# EAGLE design arduinoDcc1.2 (EAGLE 6.6.0)
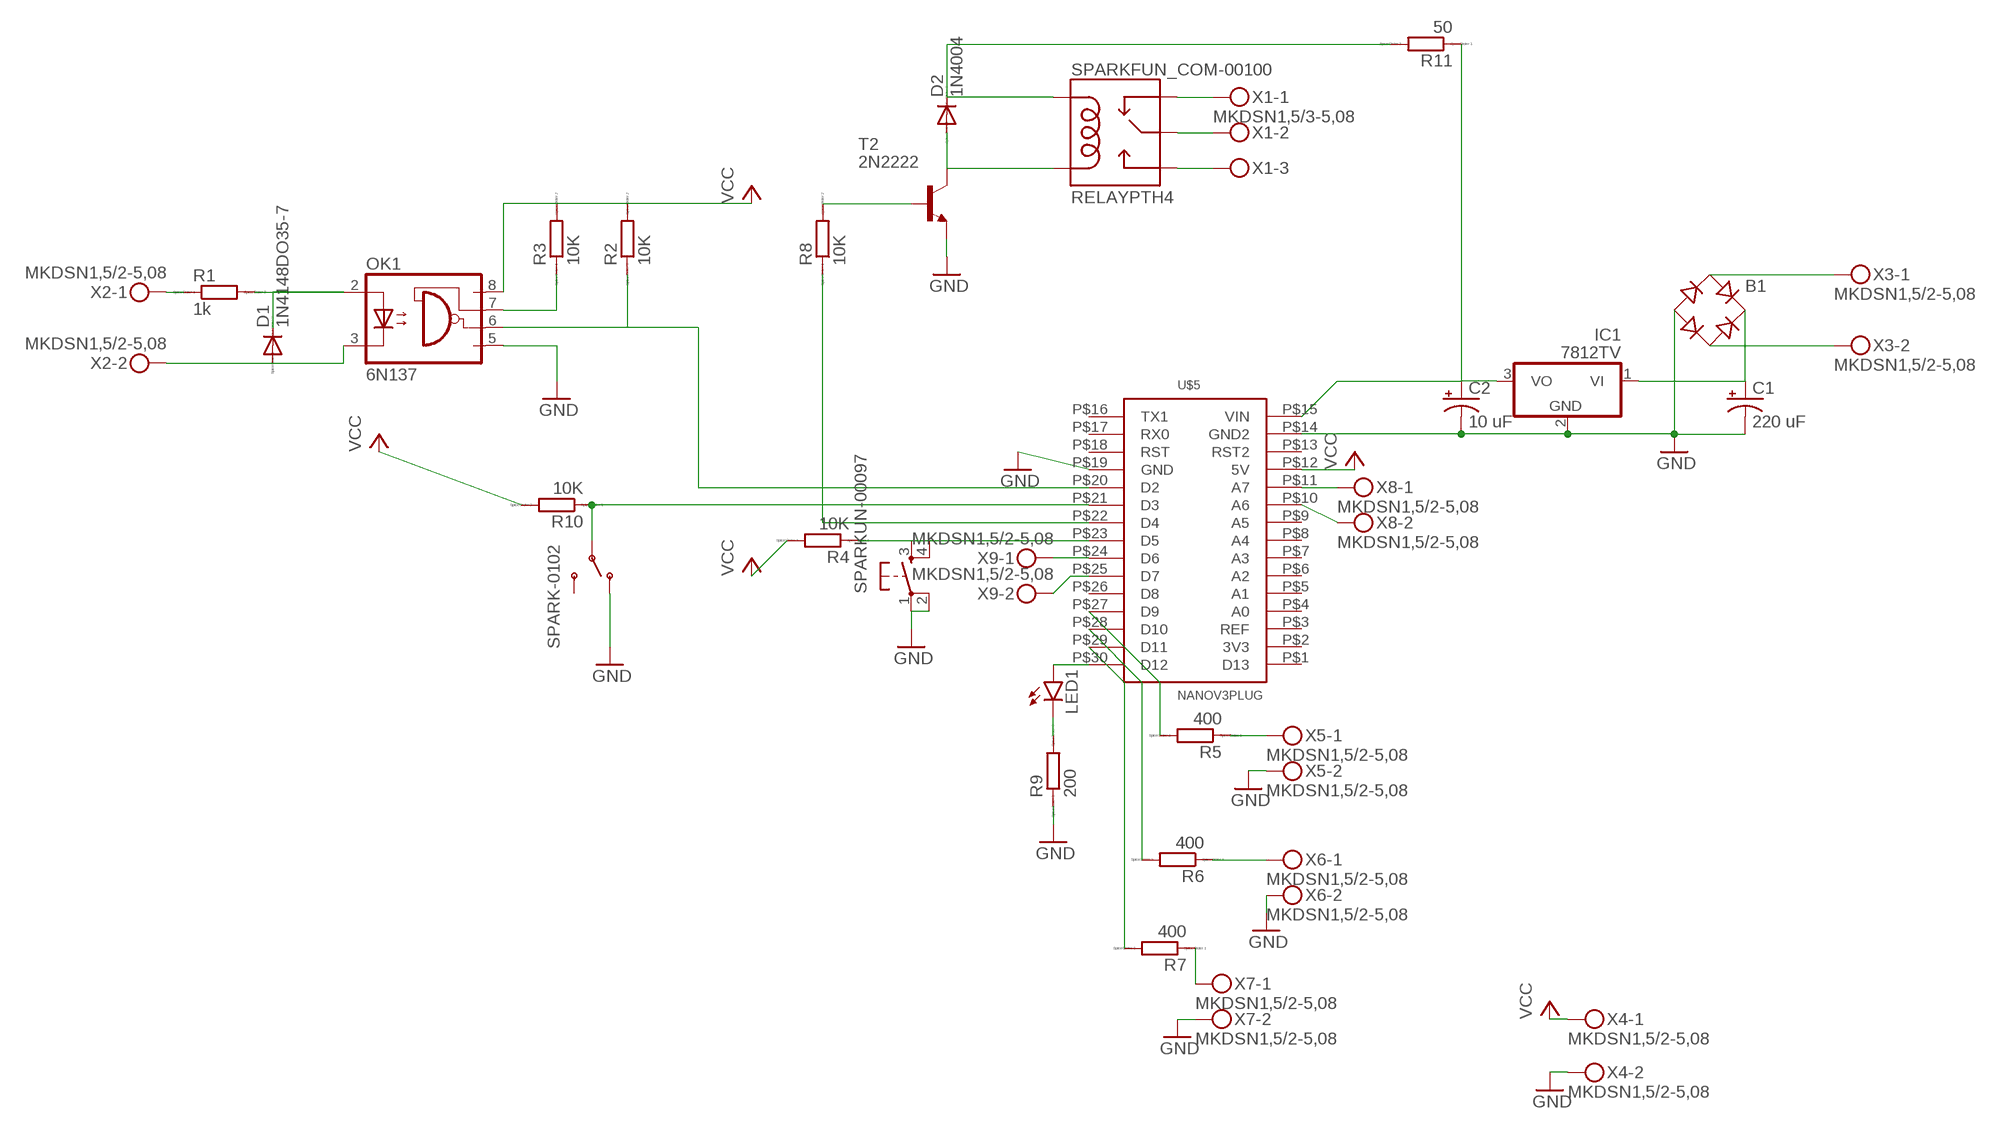
[diagram p0: schematic, sheet 1]

## Parts
B1  RB1A  [RB1A]
C1  220 uF  CAP_POLPTH1  [CPOL-RADIAL-100UF-25V]
C2  10 uF  CAP_POLPTH1  [CPOL-RADIAL-100UF-25V]
D1  1N4148DO35-7  [DO35-7]
D2  1N4004  [DO41-10]
IC1  7812TV  [TO220V]
LED1  LED3MM  [LED3MM]
OK1  6N137  [DIL08]
R1  1k  R0207/10  [0207/10]
R2  10K  R0207/10  [0207/10]
R3  10K  R0207/10  [0207/10]
R4  10K  R0207/10  [0207/10]
R5  400  R0207/10  [0207/10]
R6  400  R0207/10  [0207/10]
R7  400  R0207/10  [0207/10]
R8  10K  R0207/10  [0207/10]
R9  200  R0204/7  [0204/7]
R10  10K  R0207/10  [0207/10]
R11  50  R0207/10  [0207/10]
SPARK-0102  SWITCH-SPDTPTH  [SWITCH-SPDT]
SPARKFUN_COM-00100  RELAYPTH4  [RELAY-JZC]
SPARKUN-00097  TAC_SWITCHPTH  [TACTILE-PTH]
T2  2N2222  [TO18]
U$5  NANOV3PLUG  [HEADER15-2]
X1  MKDSN1,5/3-5,08  [MKDSN1,5/3-5,08]
X2  MKDSN1,5/2-5,08  [MKDSN1,5/2-5,08]
X3  MKDSN1,5/2-5,08  [MKDSN1,5/2-5,08]
X4  MKDSN1,5/2-5,08  [MKDSN1,5/2-5,08]
X5  MKDSN1,5/2-5,08  [MKDSN1,5/2-5,08]
X6  MKDSN1,5/2-5,08  [MKDSN1,5/2-5,08]
X7  MKDSN1,5/2-5,08  [MKDSN1,5/2-5,08]
X8  MKDSN1,5/2-5,08  [MKDSN1,5/2-5,08]
X9  MKDSN1,5/2-5,08  [MKDSN1,5/2-5,08]

## Nets
GND: B1.- C1.2(-) C2.2(-) IC1.2(GND) OK1.5(GND) R9.1 SPARK-0102.1(O) SPARKUN-00097.1 SPARKUN-00097.2 T2.1(E) U$5.P$14(GND2) U$5.P$19(GND) X4.2 X5.2 X6.2 X7.2
N$1: R1.1 X2.1
N$2: D1.C OK1.2(A) R1.2
N$3: D1.A OK1.3(C) X2.2
N$4: R10.1 SPARK-0102.2(P) U$5.P$21(D3)
N$5: D2.A SPARKFUN_COM-00100.1(COIL2) T2.3(C)
N$6: OK1.6(VO) R2.1 U$5.P$20(D2)
N$7: OK1.7(VE) R3.1
N$8: B1.AC1 X3.1
N$9: SPARKFUN_COM-00100.2(NC) X1.1
N$10: SPARKFUN_COM-00100.4(MAIN) X1.2
N$11: SPARKFUN_COM-00100.3(NO) X1.3
N$12: R8.1 U$5.P$22(D4)
N$13: R6.1 X6.1
N$14: R7.2 U$5.P$29(D11)
N$15: R6.2 U$5.P$28(D10)
N$16: R5.2 U$5.P$27(D9)
N$17: R5.1 X5.1
N$18: R4.1 SPARKUN-00097.3 SPARKUN-00097.4 U$5.P$23(D5)
N$19: U$5.P$24(D6) X9.1
N$20: U$5.P$25(D7) X9.2
N$21: U$5.P$11(A7) X8.1
N$22: U$5.P$10(A6) X8.2
N$23: B1.AC2 X3.2
N$24: B1.+ C1.1(+) IC1.1(VI)
N$25: LED1.K(C) R9.2
N$26: LED1.A U$5.P$30(D12)
N$27: R7.1 X7.1
N$28: C2.1(+) IC1.3(VO) R11.1 U$5.P$15(VIN)
N$29: R8.2 T2.2(B)
N$30: D2.C R11.2 SPARKFUN_COM-00100.5(COIL1)
VCC: OK1.8(VCC) R2.2 R3.2 R4.2 R10.2 U$5.P$12(5V) X4.1
Unconnected: SPARK-0102.3(S) U$5.P$1(D13) U$5.P$2(3V3) U$5.P$3(REF) U$5.P$4(A0) U$5.P$5(A1) U$5.P$6(A2) U$5.P$7(A3) U$5.P$8(A4) U$5.P$9(A5) U$5.P$13(RST2) U$5.P$16(TX1) U$5.P$17(RX0) U$5.P$18(RST) U$5.P$26(D8)

## Library data of the parts
B1 = rectifier:RB1A: RECTIFIER 1 A
C1 C2 = SparkFun-Capacitors:CAP_POL: Capacitor Polarized These are standard SMD and PTH capacitors. Normally 10uF, 47uF, and 100uF in electrolytic and tantalum varieties. Always verify the external diameter of the through hole cap, it varies with capacity, voltage, and manufacturer. The EIA devices should be standard.
D1 = diode:1N4148: DIODE high speed (Philips)
D2 = diode:1N4004: DIODE general purpose rectifier, 1 A
IC1 = linear:78*: Positive VOLTAGE REGULATOR Source: http://cache.national.com/ds/LM/LM78L05.pdf http://www.fairchildsemi.com/ds/LM/LM7805.pdf
LED1 = SparkFun-LED:LED: LEDs Standard schematic elements and footprints for 5mm, 3mm, 1206, and 0603 sized LEDs. 5mm - Spark Fun Electronics SKU : COM-00529 (and others)
OK1 = optocoupler:6N137: MOTOROLA OPTO COUPLER; MPN: 6N137; OC_FARNELL: 1328376; OC_NEWARK: 52M1895
R1-R11 = eagle-ltspice:R: RESISTOR, European symbol; SPICEMODEL: NONE; SPICEPREFIX: R
SPARK-0102 = SparkFun-Electromechanical:SWITCH-SPDT: SPDT Switch Simple slide switch, Spark Fun Electronics SKU : COM-00102 DPDT SMT slide switch, AYZ0202, SWCH-08179
SPARKFUN_COM-00100 = SparkFun-Electromechanical:RELAY: SPDT relay (COM-00101)
SPARKUN-00097 = SparkFun-Electromechanical:TAC_SWITCH: Momentary Switch Button commonly used for reset or general input. Spark Fun Electronics SKU : COM-00097 SMT- SWCH-08247
T2 = transistor:2N2222: NPN TRANSISTOR
U$5 = ArduinoNanoPlug:NANOV3PLUG
X1 = con-phoenix-508:MKDSN1,5/3-5,08: MKDSN 1,5/ 3-5,08 Printklemme Nennstrom: 13,5 A Nennspannung: 250 V Rastermaß: 5,08 mm Polzahl: 3 Anschlussart: Schraubanschluss Montage: Löten Anschlussrichtung Leiter/Platine: 0 ° Artikelnummer: 1729131 Source: http://eshop.phoenixcontact.com .. 1729131.pdf
X2-X9 = con-phoenix-508:MKDSN1,5/2-5,08: MKDSN 1,5/ 2-5,08 Printklemme Nennstrom: 13,5 A Nennspannung: 250 V Rastermaß: 5,08 mm Polzahl: 2 Anschlussart: Schraubanschluss Montage: Löten Anschlussrichtung Leiter/Platine: 0 ° Artikelnummer: 1729128 Source: http://eshop.phoenixcontact.com .. 1729128.pdf

## Board
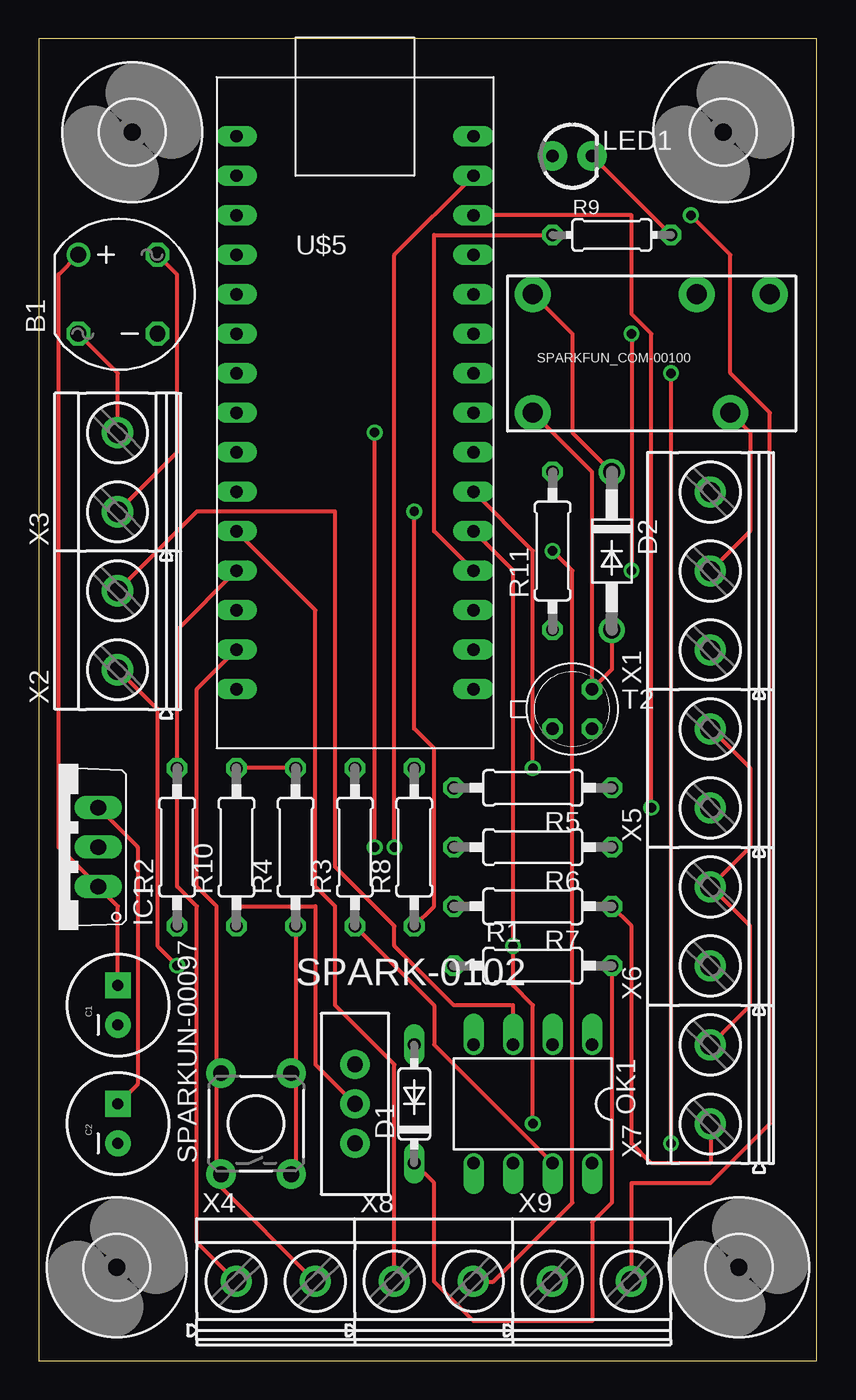
[diagram p1: board, top side]
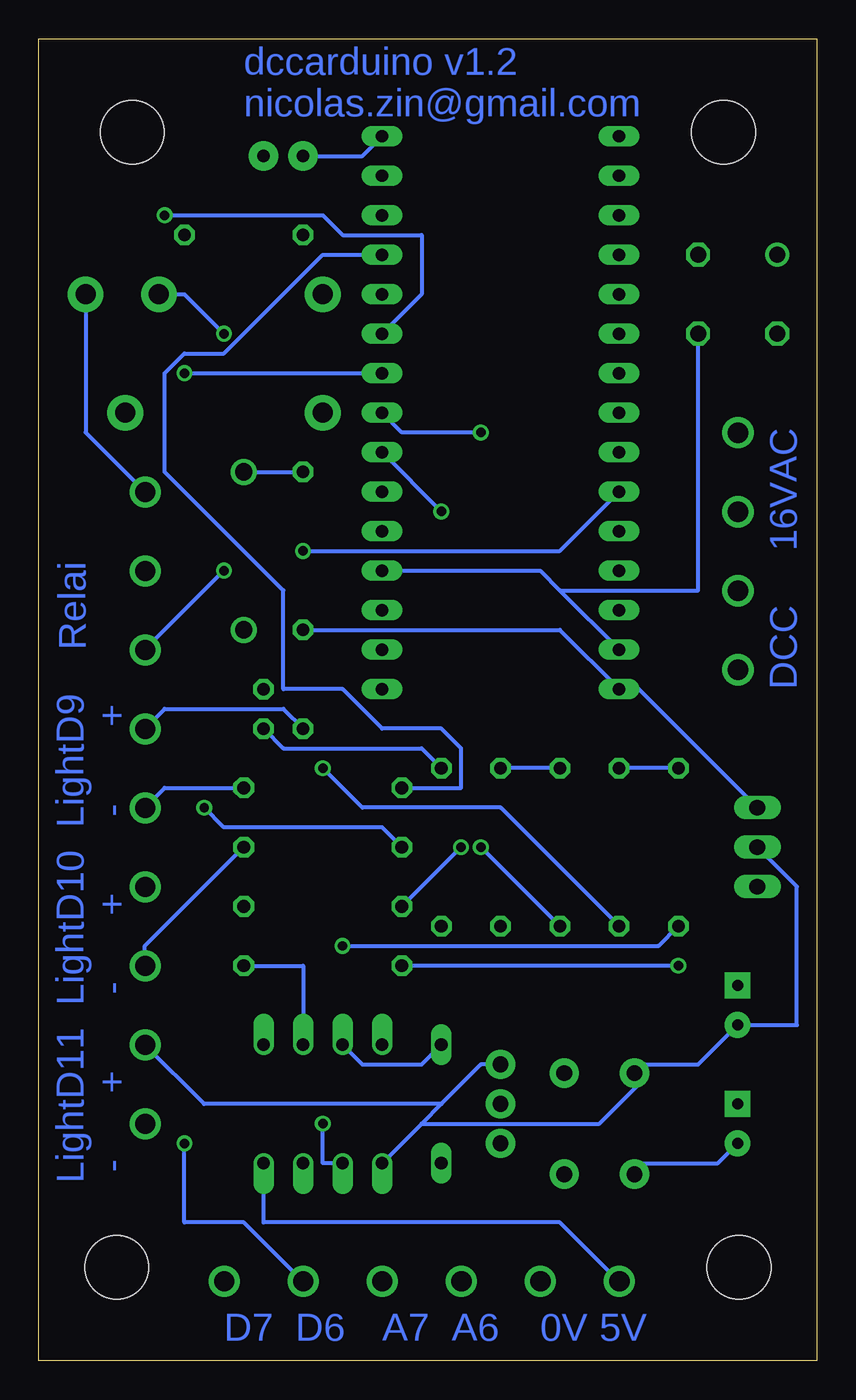
[diagram p2: board, bottom side, seen from below]

Size 50 x 85 mm. Coordinates in mm from the lower left corner, seen from the top.
Outline: 0,0 50,0 50,85 0,85 0,0
Copper layers (1*16): Top 0.035mm / dielectric 1.5mm / Bottom 0.035mm
Design rules "default": minimum track width 10mil, minimum drill 24mil, track to track 8mil, track to pad 8mil, pad to pad 8mil, via to via 8mil, smd to smd 8mil, copper to edge 40mil, drill to drill 8mil, minimum pad ring 10mil, minimum via ring 8mil, stop-mask expansion 4mil, vias tented up to drill 0mil, thermal gap 10mil

### Footprints (pad centres in the part's own frame; a part is rotated, then mirrored left to right if it is on the bottom)
RB1A = drill 1.016: + -2.54,2.54 | drill 1.016 octagon: - 2.54,-2.54; AC1 2.54,2.54; AC2 -2.54,-2.54
CPOL-RADIAL-100UF-25V = drill 0.7 pad 1.651 square: 1 1.27,0 | drill 0.7 pad 1.651: 2 -1.27,0
DO35-7 = drill 0.813 long: A 3.81,0; C -3.81,0
DO41-10 = drill 1.118: A 5.08,0; C -5.08,0
TO220V = drill 1.016 long: 1 -2.54,-2.54; 2 0,-2.54; 3 2.54,-2.54
LED3MM = drill 0.813 pad 1.88: A -1.27,0; K 1.27,0
DIL08 = drill 0.813 offset: 1 -3.81,-3.81; 2 -1.27,-3.81; 3 1.27,-3.81; 4 3.81,-3.81; 5 3.81,3.81; 6 1.27,3.81; 7 -1.27,3.81; 8 -3.81,3.81
0207/10 = drill 0.813 octagon: 1 -5.08,0; 2 5.08,0
0204/7 = drill 0.813 octagon: 1 -3.81,0; 2 3.81,0
SWITCH-SPDT = drill 1.016 pad 1.88: 1 0,2.54; 2 0,0; 3 0,-2.54
RELAY-JZC = drill 1.3 pad 2.286: 1 3.81,-8.89; 2 -3.81,1.651; 3 -3.81,6.35; 4 3.81,3.81; 5 -3.81,-8.89
TACTILE-PTH = drill 1.016 pad 1.88: 1 -3.251,2.261; 2 3.251,2.261; 3 -3.251,-2.261; 4 3.251,-2.261
TO18 = drill 0.813 octagon: 1 -1.27,-1.27; 2 1.27,-1.27; 3 1.27,1.27
4,1 = hole 4.1: 0,0
HEADER15-2 = drill 0.8 long: P$1 -7.62,17.78; P$2 -7.62,15.24; P$3 -7.62,12.7; P$4 -7.62,10.16; P$5 -7.62,7.62; P$6 -7.62,5.08; P$7 -7.62,2.54; P$8 -7.62,0; P$9 -7.62,-2.54; P$10 -7.62,-5.08; P$11 -7.62,-7.62; P$12 -7.62,-10.16; P$13 -7.62,-12.7; P$14 -7.62,-15.24; P$15 -7.62,-17.78; P$16 7.62,-17.78; P$17 7.62,-15.24; P$18 7.62,-12.7; P$19 7.62,-10.16; P$20 7.62,-7.62; P$21 7.62,-5.08; P$22 7.62,-2.54; P$23 7.62,0; P$24 7.62,2.54; P$25 7.62,5.08; P$26 7.62,7.62; P$27 7.62,10.16; P$28 7.62,12.7; P$29 7.62,15.24; P$30 7.62,17.78
MKDSN1,5/3-5,08 = drill 1.3 pad 2: 1 -7.641,0.025; 2 -2.561,0.025; 3 2.519,0.025
MKDSN1,5/2-5,08 = drill 1.3 pad 2: 1 -2.561,0.025; 2 2.519,0.025

### Placement (x,y rotation side)
B1  5.08,68.58 0 top
C1  5.08,22.86 90 top
C2  5.08,15.24 90 top
D1  24.13,16.51 90 top
D2  36.83,52.07 270 top
IC1  1.27,33.02 90 top
LED1  34.29,77.47 0 top
OK1  31.75,16.51 180 top
R1  31.75,25.4 0 top
R2  8.89,33.02 90 top
R3  20.32,33.02 90 top
R4  16.51,33.02 90 top
R5  31.75,36.83 180 top
R6  31.75,33.02 180 top
R7  31.75,29.21 180 top
R8  24.13,33.02 90 top
R9  36.83,72.39 0 top
R10  12.7,33.02 90 top
R11  33.02,52.07 90 top
SPARK-0102  20.32,16.51 0 top
SPARKFUN_COM-00100  40.64,64.77 270 top
SPARKUN-00097  13.97,15.24 90 top
T2  34.29,41.91 0 top
U$1  [4,1]  5,6 0 top
U$2  [4,1]  6,79 0 top
U$3  [4,1]  45,6 0 top
U$4  [4,1]  44,79 0 top
U$5  20.32,60.96 0 top
X1  43.18,53.34 90 top
X2  5.08,46.99 90 top
X3  5.08,57.15 90 top
X4  15.24,5.08 0 top
X5  43.18,38.1 90 top
X6  43.18,27.94 90 top
X7  43.18,17.78 90 top
X8  25.4,5.08 0 top
X9  35.56,5.08 0 top

### Tracks (layer width: path | path; a pad name or v marks a point on that pad's centre or on a via)
GND
  Top 0.254: R9.1 25.4,72.39 25.4,53.34 U$5.P$19 | X4.2 17.78,5.08 11.43,11.43 SPARKUN-00097.1 11.43,12.7 11.43,17.78 SPARKUN-00097.2 11.43,19.05 11.43,29.21 10.16,30.48 10.16,43.18 U$5.P$14 | 43.18,30.48 45.72,33.02 45.72,38.1 43.18,40.64 X5.2 | 43.18,30.48 45.72,27.94 45.72,22.86 43.18,20.32 X7.2 | 43.18,30.48 X6.2
  Bottom 0.254: 16.51,49.53 17.78,50.8 U$5.P$19 | 16.51,49.53 U$5.P$14 | B1.- 7.62,49.53 16.51,49.53 | IC1.2 1.27,30.48 1.27,21.59 C1.2 7.62,19.05 11.43,19.05 SPARKUN-00097.2 11.43,17.78 13.97,15.24 25.4,15.24 | C2.2 6.35,12.7 11.43,12.7 SPARKUN-00097.1 | T2.1 34.29,41.91 41.91,41.91 43.18,40.64 X5.2 | 24.13,16.51 21.59,19.05 SPARK-0102.1 | 24.13,16.51 25.4,15.24 | 25.4,15.24 OK1.5 | 24.13,16.51 39.37,16.51 43.18,20.32 X7.2
N$1  (via drill 0.61)
  Top 0.254: v8.89,25.4 7.62,26.67 7.62,41.91 5.08,44.45 X2.1
  Bottom 0.254: v8.89,25.4 R1.1
N$2
  Top 0.254: D1.C 25.4,11.43 25.4,5.08 27.94,2.54 35.56,2.54 35.56,8.89 36.83,10.16 R1.2
  Bottom 0.254: OK1.2 33.02,25.4 R1.2
N$3
  Top 0.254: OK1.3 30.48,22.86 26.67,22.86 22.86,26.67 22.86,27.94 19.05,31.75 19.05,54.61 10.16,54.61 5.08,49.53 X2.2
  Bottom 0.254: D1.A 25.4,19.05 29.21,19.05 OK1.3
N$4  (via drill 0.61)
  Top 0.254: U$5.P$21 31.75,52.07 v31.75,38.1 | SPARK-0102.2 17.78,19.05 17.78,29.21 12.7,29.21 R10.1
  Bottom 0.254: v31.75,38.1 29.21,35.56 20.32,35.56 R10.1
N$5
  Top 0.254: D2.A 36.83,44.45 T2.3 35.56,57.15 SPARKFUN_COM-00100.1
N$6  (via drill 0.61)
  Top 0.254: U$5.P$20 30.48,50.8 v30.48,26.67 30.48,24.13 31.75,22.86 v31.75,15.24
  Bottom 0.254: v31.75,15.24 31.75,12.7 OK1.6 | R2.1 10.16,26.67 v30.48,26.67
N$7
  Top 0.254: OK1.7 25.4,20.32 25.4,22.86 R3.1
N$8
  Top 0.254: B1.AC1 8.89,69.85 8.89,58.42 5.08,54.61 X3.1
N$9  (via drill 0.61)
  Top 0.254: v38.1,66.04 v38.1,50.8
  Bottom 0.254: v38.1,50.8 43.18,45.72 X1.1 | v38.1,66.04 40.64,68.58 SPARKFUN_COM-00100.2
N$10
  Top 0.254: SPARKFUN_COM-00100.4 45.72,59.69 45.72,53.34 43.18,50.8 X1.2
N$11
  Bottom 0.254: SPARKFUN_COM-00100.3 46.99,59.69 43.18,55.88 X1.3
N$12  (via drill 0.61)
  Top 0.254: v24.13,54.61 24.13,40.64 25.4,39.37 25.4,29.21 R8.1
  Bottom 0.254: v24.13,54.61 U$5.P$22
N$13
  Bottom 0.254: R6.1 43.18,26.67 43.18,25.4 X6.1
N$14  (via drill 0.61)
  Top 0.254: U$5.P$29 22.86,71.12 v22.86,33.02
  Bottom 0.254: R7.2 v22.86,33.02
N$15  (via drill 0.61)
  Top 0.254: U$5.P$28 38.1,73.66 38.1,67.31 39.37,66.04 v39.37,35.56
  Bottom 0.254: v39.37,35.56 38.1,34.29 27.94,34.29 R6.2
N$16
  Bottom 0.254: U$5.P$27 31.75,71.12 38.1,64.77 40.64,64.77 41.91,63.5 41.91,57.15 34.29,49.53 34.29,43.18 30.48,43.18 27.94,40.64 24.13,40.64 22.86,39.37 22.86,36.83 R5.2
N$17
  Bottom 0.254: R5.1 41.91,36.83 43.18,35.56 X5.1
N$18  (via drill 0.61)
  Top 0.254: SPARKUN-00097.3 16.51,12.7 16.51,17.78 SPARKUN-00097.4 16.51,19.05 R4.1 | v21.59,33.02 v21.59,59.69
  Bottom 0.254: U$5.P$23 26.67,59.69 v21.59,59.69 | R4.1 v21.59,33.02
N$19  (via drill 0.61)
  Top 0.254: v40.64,13.97 v40.64,63.5
  Bottom 0.254: v40.64,63.5 U$5.P$24 | v40.64,13.97 40.64,8.89 36.83,8.89 33.02,5.08 X9.1
N$20  (via drill 0.61)
  Top 0.254: v41.91,73.66 44.45,71.12 44.45,63.5 46.99,60.96 46.99,15.24 43.18,11.43 38.1,11.43 38.1,5.08 X9.2
  Bottom 0.254: U$5.P$25 25.4,68.58 25.4,72.39 30.48,72.39 31.75,73.66 v41.91,73.66
N$21
  Top 0.254: U$5.P$11 17.78,48.26 17.78,30.48 19.05,29.21 19.05,22.86 22.86,19.05 22.86,5.08 X8.1
N$22  (via drill 0.61)
  Top 0.254: v33.02,52.07 34.29,50.8 34.29,10.16 29.21,5.08 27.94,5.08 X8.2
  Bottom 0.254: U$5.P$10 16.51,52.07 v33.02,52.07
N$23
  Top 0.254: B1.AC2 5.08,63.5 5.08,59.69 X3.2
N$24
  Top 0.254: C1.1 5.08,29.21 IC1.1 1.27,33.02 1.27,69.85 B1.+
N$25
  Top 0.254: LED1.K R9.2
N$26
  Bottom 0.254: U$5.P$30 29.21,77.47 LED1.A
N$27
  Top 0.254: R7.1 38.1,27.94 38.1,13.97 39.37,12.7 43.18,12.7 43.18,15.24 X7.1
N$28
  Top 0.254: C2.1 6.35,17.78 6.35,33.02 IC1.3
  Bottom 0.254: R11.1 16.51,46.99 U$5.P$15 11.43,43.18 IC1.3
N$29
  Bottom 0.254: R8.2 25.4,39.37 34.29,39.37 T2.2
N$30
  Top 0.254: D2.C 34.29,59.69 34.29,66.04 SPARKFUN_COM-00100.5
  Bottom 0.254: D2.C R11.2
VCC
  Top 0.254: R4.2 R10.2 | U$5.P$12 8.89,46.99 R2.2 8.89,30.48 10.16,29.21 10.16,7.62 12.7,5.08 X4.1
  Bottom 0.254: R4.2 R3.2 | R2.2 R10.2 | OK1.8 35.56,8.89 16.51,8.89 12.7,5.08 X4.1

### Text on the board
Bottom: dccarduino v1.2 / nicolas.zin@gmail.com | 16VAC | Relai | DCC | LightD9 / - + | LightD10 / - + | LightD11 / - + | 5V | 0V | A7 A6 | D7 D6